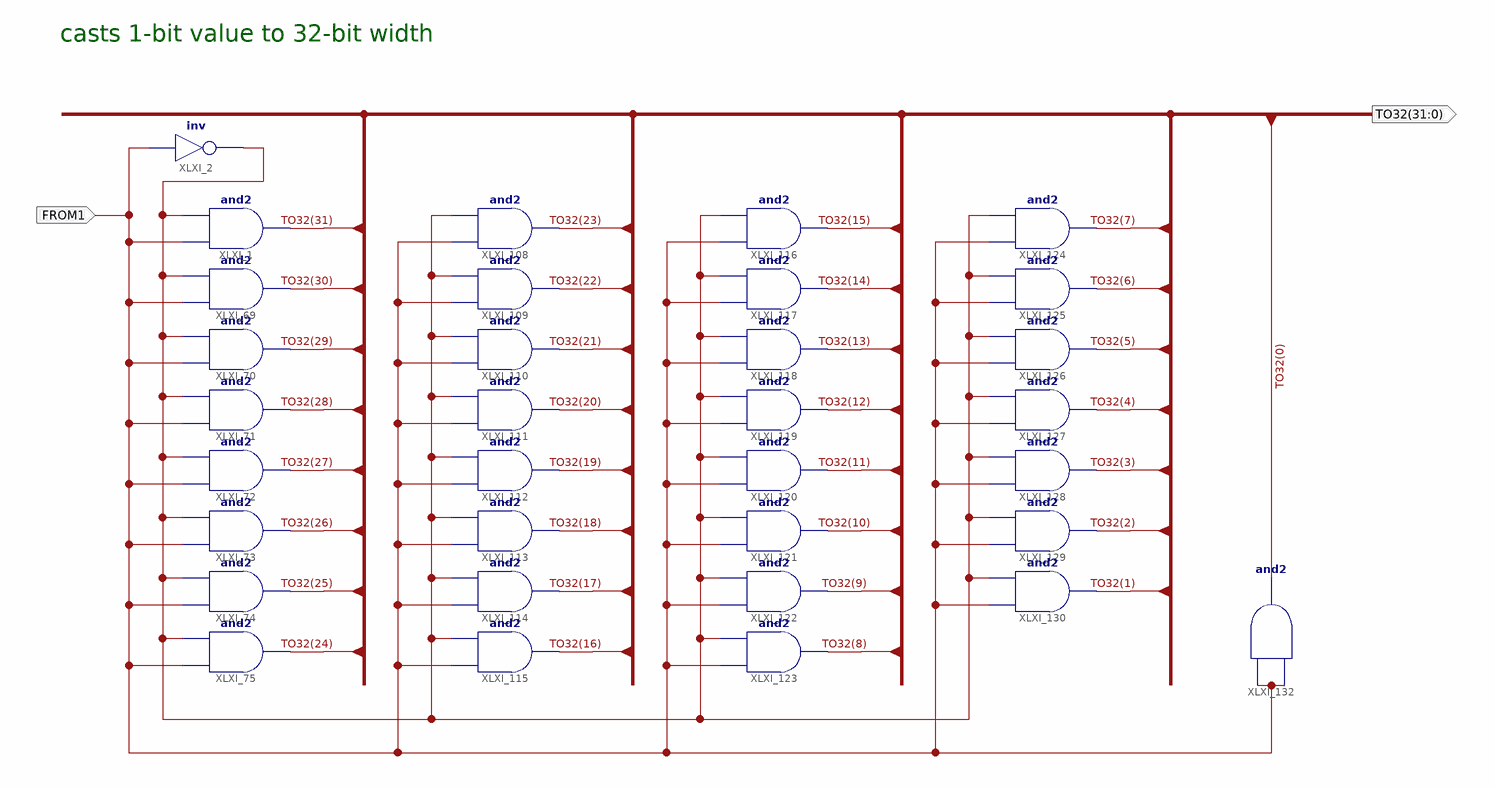
[diagram p0: schematic sheet 1]
// Xilinx ISE schematic cast1to32.sch (spartan3e) as structural Verilog: 33 symbols, 2 ports
module cast1to32 (
  input  FROM1,
  output [31:0] TO32
);

  wire XLXN_131;

  not XLXI_2 (XLXN_131, FROM1);
  and XLXI_74 (TO32[25], FROM1, XLXN_131);
  and XLXI_73 (TO32[26], FROM1, XLXN_131);
  and XLXI_75 (TO32[24], FROM1, XLXN_131);
  and XLXI_72 (TO32[27], FROM1, XLXN_131);
  and XLXI_71 (TO32[28], FROM1, XLXN_131);
  and XLXI_70 (TO32[29], FROM1, XLXN_131);
  and XLXI_69 (TO32[30], FROM1, XLXN_131);
  and XLXI_1 (TO32[31], FROM1, XLXN_131);
  and XLXI_108 (TO32[23], FROM1, XLXN_131);
  and XLXI_109 (TO32[22], FROM1, XLXN_131);
  and XLXI_110 (TO32[21], FROM1, XLXN_131);
  and XLXI_111 (TO32[20], FROM1, XLXN_131);
  and XLXI_112 (TO32[19], FROM1, XLXN_131);
  and XLXI_113 (TO32[18], FROM1, XLXN_131);
  and XLXI_114 (TO32[17], FROM1, XLXN_131);
  and XLXI_115 (TO32[16], FROM1, XLXN_131);
  and XLXI_116 (TO32[15], FROM1, XLXN_131);
  and XLXI_117 (TO32[14], FROM1, XLXN_131);
  and XLXI_118 (TO32[13], FROM1, XLXN_131);
  and XLXI_119 (TO32[12], FROM1, XLXN_131);
  and XLXI_120 (TO32[11], FROM1, XLXN_131);
  and XLXI_121 (TO32[10], FROM1, XLXN_131);
  and XLXI_122 (TO32[9], FROM1, XLXN_131);
  and XLXI_123 (TO32[8], FROM1, XLXN_131);
  and XLXI_124 (TO32[7], FROM1, XLXN_131);
  and XLXI_125 (TO32[6], FROM1, XLXN_131);
  and XLXI_126 (TO32[5], FROM1, XLXN_131);
  and XLXI_127 (TO32[4], FROM1, XLXN_131);
  and XLXI_128 (TO32[3], FROM1, XLXN_131);
  and XLXI_129 (TO32[2], FROM1, XLXN_131);
  and XLXI_130 (TO32[1], FROM1, XLXN_131);
  and XLXI_132 (TO32[0], FROM1, FROM1);

  // Notes on the sheet:
  //   casts 1-bit value to 32-bit width
endmodule
